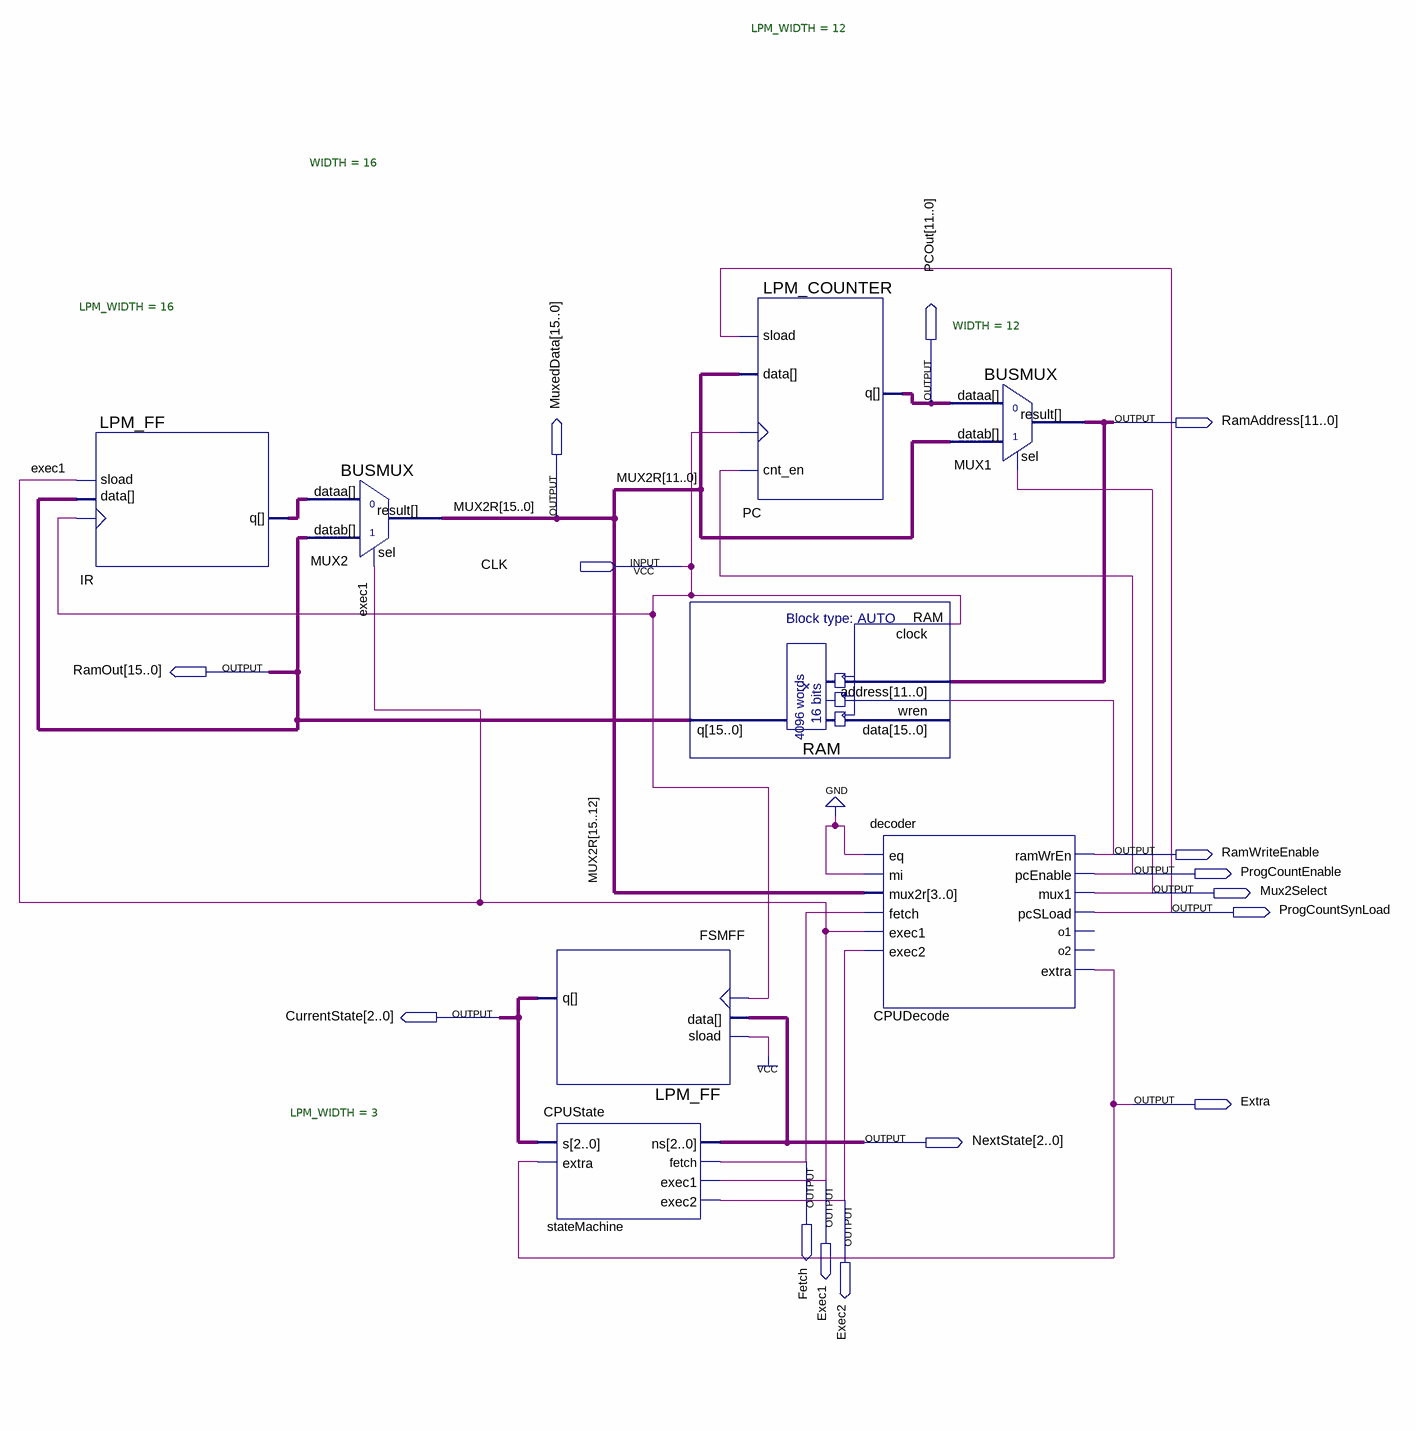
[diagram p0: schematic sheet]
// Quartus schematic MU0CPU.bdf as structural Verilog: 8 symbols, 15 pins
module MU0CPU (
  input  CLK,
  output [11:0] PCOut,
  output [11:0] RamAddress,
  output [15:0] MuxedData,
  output [15:0] RamOut,
  output RamWriteEnable,
  output ProgCountEnable,
  output Mux2Select,
  output ProgCountSynLoad,
  output [2:0] CurrentState,
  output Extra,
  output [2:0] NextState,
  output Fetch,
  output Exec1,
  output Exec2
);

  wire [15:0] IR_q;

  LPM_FF #(.LPM_WIDTH(16)) IR (.clock(CLK), .sload(Exec1), .data(RamOut), .q(IR_q));
  BUSMUX #(.WIDTH(16)) MUX2 (.datab(RamOut), .sel(Exec1), .dataa(IR_q), .result(MuxedData));
  LPM_FF #(.LPM_WIDTH(3)) FSMFF (.clock(CLK), .sload(1'b1), .data(NextState), .q(CurrentState));
  CPUState stateMachine (.s(CurrentState), .extra(Extra), .ns(NextState), .fetch(Fetch), .exec1(Exec1), .exec2(Exec2));
  RAM RAM (.wren(RamWriteEnable), .address(RamAddress), .clock(CLK), .q(RamOut));  // open: data
  LPM_COUNTER #(.LPM_WIDTH(12)) PC (
    .sload(ProgCountSynLoad), .data(MuxedData[11:0]), .clock(CLK), .cnt_en(ProgCountEnable), .q(PCOut));
  decoder CPUDecode (
    .eq(1'b0), .mi(1'b0), .mux2r(MuxedData[15:12]), .fetch(Fetch), .exec1(Exec1), .exec2(Exec2),
    .ramWrEn(RamWriteEnable), .pcEnable(ProgCountEnable), .mux1(Mux2Select), .pcSLoad(ProgCountSynLoad),
    .extra(Extra));  // open: o1, o2
  BUSMUX #(.WIDTH(12)) MUX1 (.datab(MuxedData[11:0]), .sel(Mux2Select), .dataa(PCOut), .result(RamAddress));

  // Other names for the same wires on the sheet: MUX2R[15:0] = MuxedData
endmodule
